# Altium schematic sheet sensor_connector.SchDoc
size A4; SheetNumber: 7; SheetTotal: 7
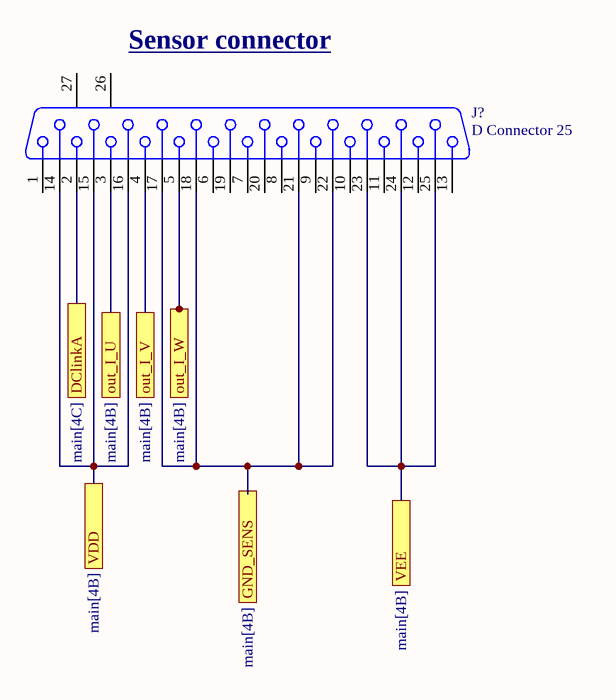
[diagram p0: sensor_connector.SchDoc]

## Parts
J?  D Connector 25  [DSUB1.385-2H25A]

## Ports
DClinkA (see main[4C]), GND_SENS (see main[4B]), out_I_U (see main[4B]), out_I_V (see main[4B]), out_I_W (see main[4B]), VDD (see main[4B]), VEE (see main[4B])

## Nets
DClinkA: J?.2 ; port DClinkA
GND_SENS: J?.17 J?.18 J?.21 J?.22 ; port GND_SENS
out_I_U: J?.3 ; port out_I_U
out_I_V: J?.4 ; port out_I_V
out_I_W: J?.5 ; port out_I_W
VDD: J?.14 J?.15 J?.16 ; port VDD
VEE: J?.23 J?.24 J?.25 ; port VEE

Not connected (* = marked no-connect by the designer): J? 1 6 7 8 9 10 11 12 13 19 20 26(MH1) 27(MH2)

## Notes on the sheet
- (near J?) Sensor connector

## Library data of the parts
J? = D Connector 25: Receptacle Assembly, 25 Position, Right Angle; PackageDocument: U; Positions: 25; Published: 15-Jun-2001; LatestRevisionDate: 17-Jul-2002; LatestRevisionNote: Re-released for DXP Platform.; DatasheetDocument: 19-Mar-1999; PackageReference: 787202; Publisher: Altium Limited; Orientation: Right Angle; Gender: Receptacle